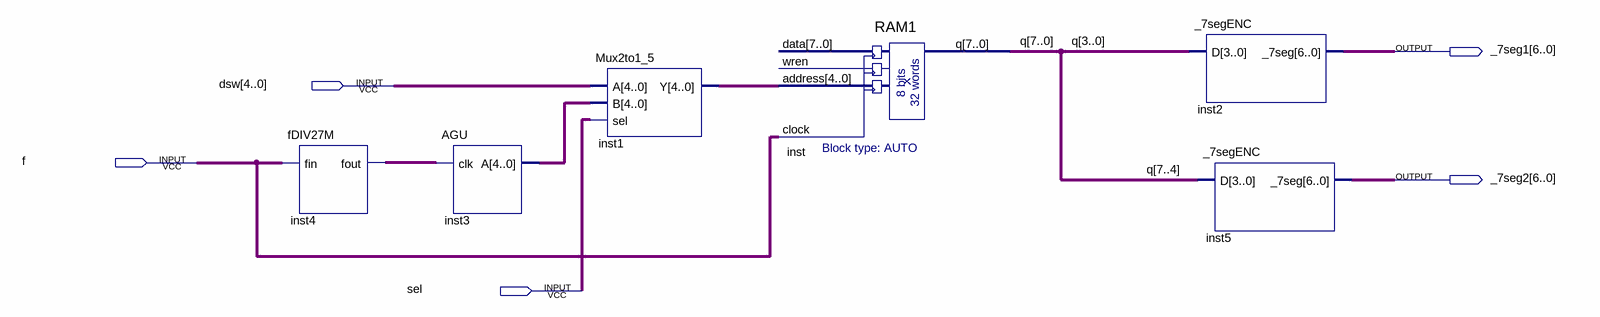
[diagram p0: schematic sheet]
// Quartus schematic hw1.bdf as structural Verilog: 6 symbols, 5 pins
module hw1 (
  input  [4:0] dsw,
  input  f,
  input  sel,
  output [6:0] _7seg1,
  output [6:0] _7seg2
);

  wire inst4_fout;
  wire [4:0] inst1_y, inst3_a;
  wire [7:0] q;

  fDIV27M inst4 (.fin(f), .fout(inst4_fout));
  AGU inst3 (.clk(inst4_fout), .A(inst3_a));
  Mux2to1_5 inst1 (.A(dsw), .B(inst3_a), .sel(sel), .Y(inst1_y));
  RAM1 inst (.address(inst1_y), .clock(f), .q(q));  // open: data, wren
  _7segENC inst2 (.D(q[3:0]), ._7seg(_7seg1));
  _7segENC inst5 (.D(q[7:4]), ._7seg(_7seg2));
endmodule
